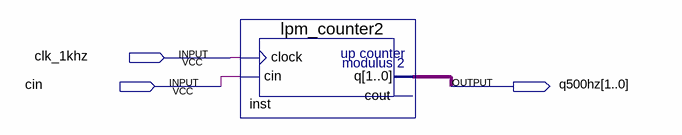
[diagram p0: schematic sheet]
// Quartus schematic cont_divfreq.bdf as structural Verilog: 1 symbols, 3 pins
module cont_divfreq (
  input  clk_1khz,
  input  cin,
  output [1:0] q500hz
);

  lpm_counter2 inst (.clock(clk_1khz), .cin(cin), .q(q500hz));  // open: cout
endmodule
